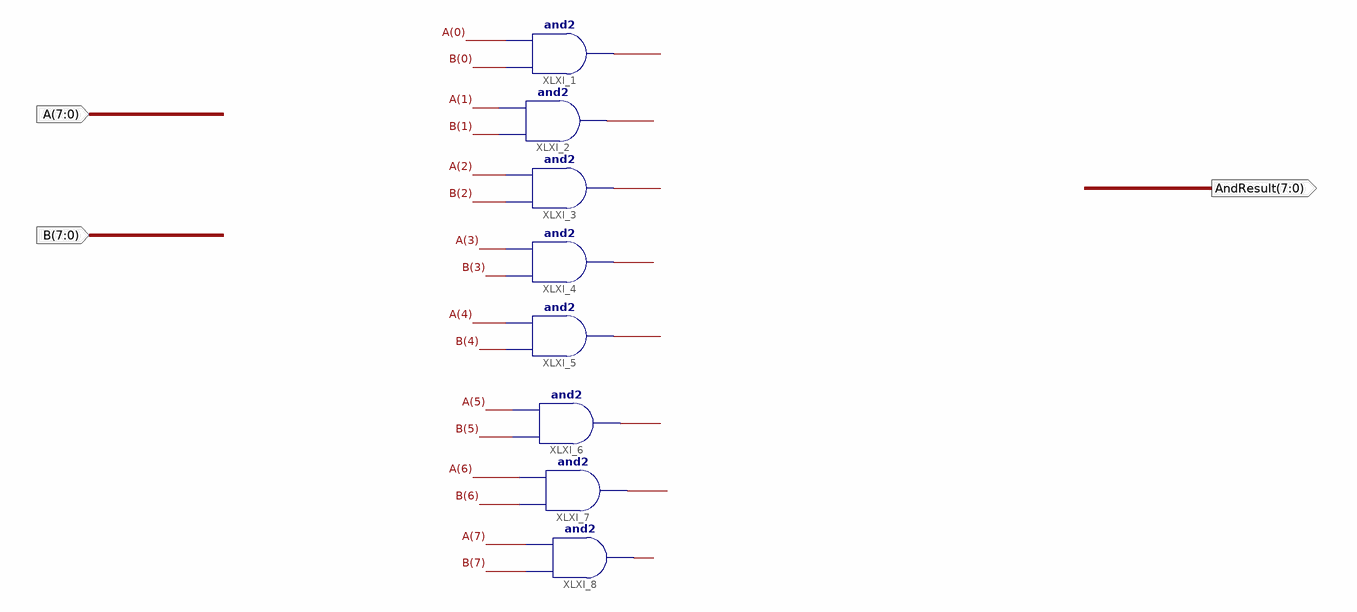
[diagram p0: schematic sheet 1]
// Xilinx ISE schematic eightBitAND.sch (spartan6) as structural Verilog: 8 symbols, 3 ports
module eightBitAND (
  input  [7:0] A,
  input  [7:0] B,
  output [7:0] AndResult
);

  and XLXI_1 (AndResult[0], B[0], A[0]);
  and XLXI_2 (AndResult[1], B[1], A[1]);
  and XLXI_3 (AndResult[2], B[2], A[2]);
  and XLXI_4 (AndResult[3], B[3], A[3]);
  and XLXI_5 (AndResult[4], B[4], A[4]);
  and XLXI_6 (AndResult[5], B[5], A[5]);
  and XLXI_7 (AndResult[6], B[6], A[6]);
  and XLXI_8 (AndResult[7], B[7], A[7]);
endmodule
